# Altium project PowCarbinBoard.PrjPCB
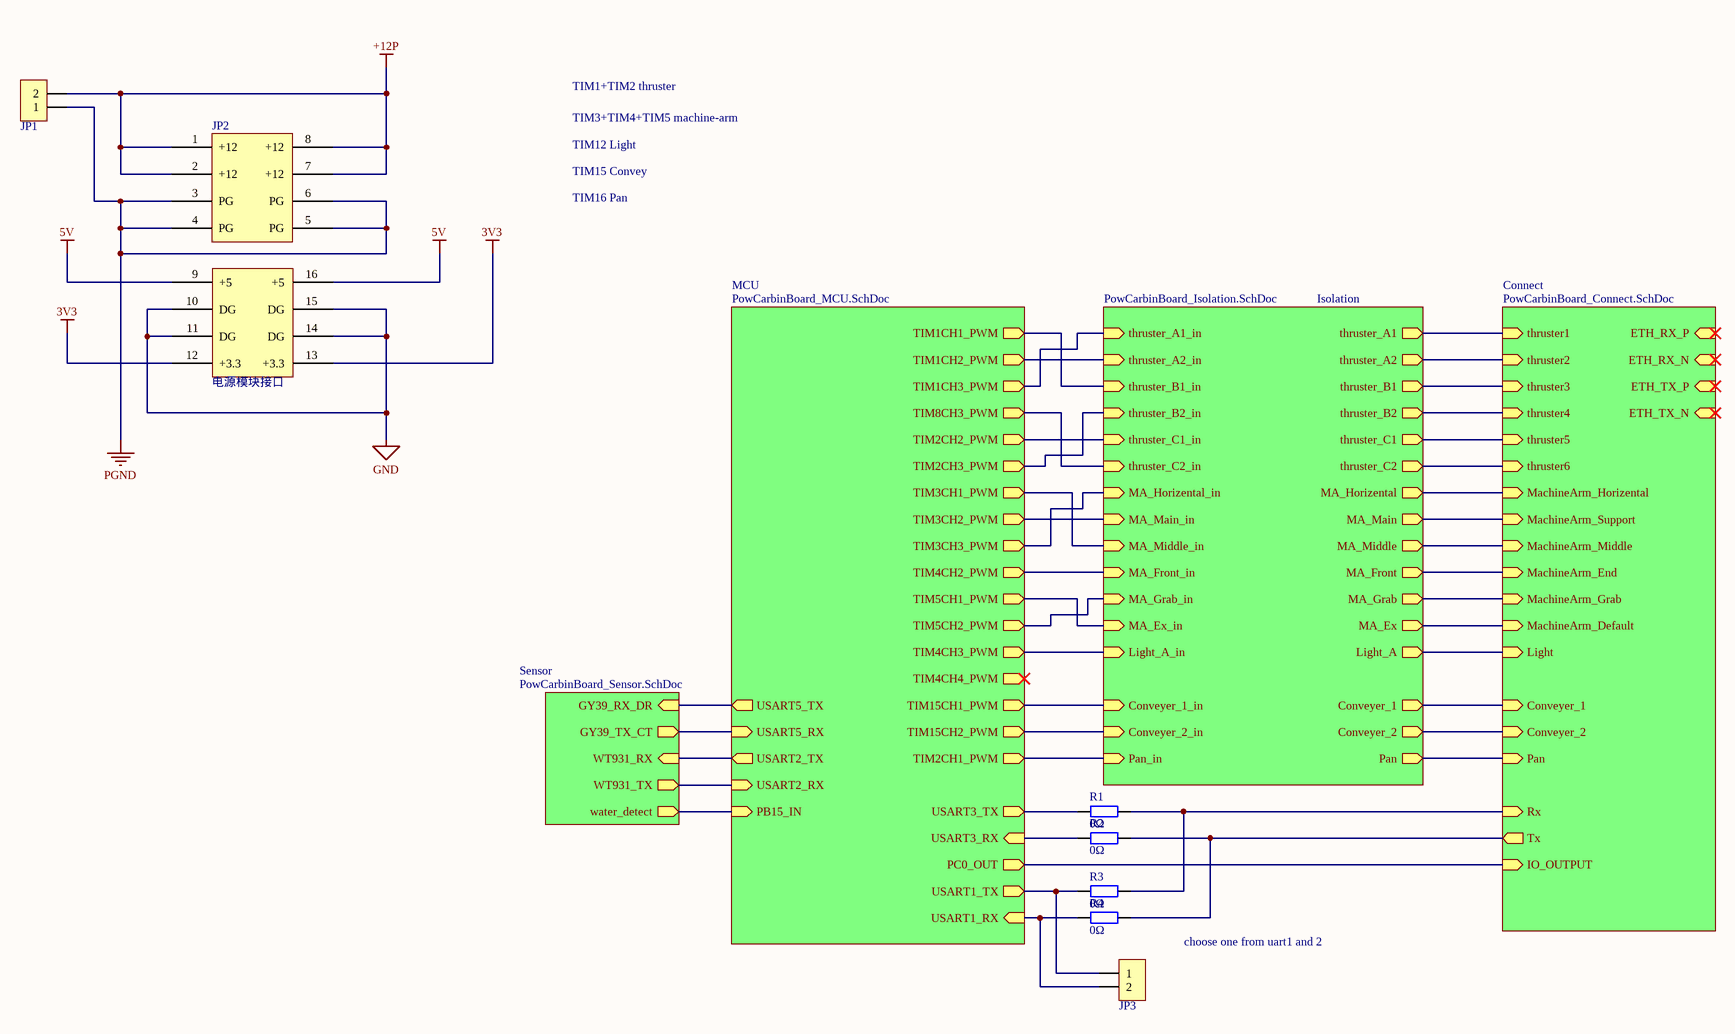
[diagram p0: PowCarbinBoard_General.SchDoc]
5 sheets, 80 parts. Net scope: hierarchical (ports join the sheet entries above them; power ports are global).
Board file: PowCarbinBoard.PcbDoc
Sheets:
  PowCarbinBoard_General.SchDoc
    MCU = PowCarbinBoard_MCU.SchDoc
    Connect = PowCarbinBoard_Connect.SchDoc
    Sensor = PowCarbinBoard_Sensor.SchDoc
    Isolation = PowCarbinBoard_Isolation.SchDoc

## Sheet PowCarbinBoard_General.SchDoc
size A3

### Parts
JP1  HDR-1X2  [KF128-5.08-2P]  (value not drawn)
JP2  电源模块接口  [排针-座 2*4]
JP3  HDR-1X2  [HDR2.54-LI-2P]  (value not drawn)
R1  0Ω  [R 0603_L]
R2  0Ω  [R 0603_L]
R3  0Ω  [R 0603_L]
R4  0Ω  [R 0603_L]

### Sub-sheets
Connect = PowCarbinBoard_Connect.SchDoc: MachineArm_End (in), MachineArm_Default (in), ETH_TX_P (in), MachineArm_Grab (in), Conveyer_2 (in), IO_OUTPUT (in), Conveyer_1 (in), ETH_RX_P (in), MachineArm_Support (in), ETH_RX_N (in), thruster6 (in), Rx (in), thruster1 (in), ETH_TX_N (in), MachineArm_Horizental (in), Light (in), thruster5 (in), MachineArm_Middle (in), Tx (out), thruster3 (in), thruster2 (in), Pan (in), thruster4 (in)
Isolation = PowCarbinBoard_Isolation.SchDoc: thruster_A2_in (in), MA_Grab (out), Conveyer_1 (out), MA_Ex_in (in), MA_Middle_in (in), thruster_B2 (out), thruster_C2_in (in), MA_Ex (out), thruster_A1 (out), thruster_B2_in (in), MA_Front_in (in), thruster_A1_in (in), Pan (out), Light_A_in (in), MA_Main (out), MA_Middle (out), thruster_C1_in (in), thruster_B1_in (in), MA_Front (out), Light_A (out), thruster_B1 (out), thruster_C1 (out), thruster_C2 (out), Pan_in (in), Conveyer_2_in (in), MA_Grab_in (in), MA_Main_in (in), thruster_A2 (out), Conveyer_2 (out), MA_Horizental (out), MA_Horizental_in (in), Conveyer_1_in (in)
MCU = PowCarbinBoard_MCU.SchDoc: TIM3CH2_PWM (out), USART2_RX (in), TIM3CH1_PWM (out), TIM2CH3_PWM (out), TIM2CH2_PWM (out), TIM2CH1_PWM (out), TIM1CH2_PWM (out), TIM1CH3_PWM (out), USART2_TX (out), TIM1CH1_PWM (out), USART1_RX (in), USART1_TX (out), USART3_RX (in), USART5_RX (in), USART3_TX (out), TIM5CH2_PWM (out), USART5_TX (out), TIM15CH2_PWM (out), TIM5CH1_PWM (out), TIM4CH2_PWM (out), TIM15CH1_PWM (out), PB15_IN (in), PC0_OUT (out), TIM3CH3_PWM (out), TIM4CH4_PWM (out), TIM4CH3_PWM (out), TIM8CH3_PWM (out)
Sensor = PowCarbinBoard_Sensor.SchDoc: water_detect (out), GY39_TX_CT (out), WT931_RX (in), GY39_RX_DR (in), WT931_TX (out)

### Nets
3V3: JP2.12(+3.3) JP2.13(+3.3)
5V: JP2.9(+5) JP2.16(+5)
+12P: JP1.2 JP2.1(+12) JP2.2(+12) JP2.7(+12) JP2.8(+12)
GND: JP2.10(DG) JP2.11(DG) JP2.14(DG) JP2.15(DG)
PGND: JP1.1 JP2.3(PG) JP2.4(PG) JP2.5(PG) JP2.6(PG)
NetJ1_1: sheet Connect/MachineArm_Horizental, sheet Isolation/MA_Horizental
NetJ1_2: sheet Connect/MachineArm_Support, sheet Isolation/MA_Main
NetJ1_3: sheet Connect/MachineArm_Middle, sheet Isolation/MA_Middle
NetJ2_1: sheet Connect/MachineArm_End, sheet Isolation/MA_Front
NetJ2_2: sheet Connect/MachineArm_Grab, sheet Isolation/MA_Grab
NetJ2_3: sheet Connect/MachineArm_Default, sheet Isolation/MA_Ex
NetJ3_1: sheet Connect/Conveyer_1, sheet Isolation/Conveyer_1
NetJ3_2: sheet Connect/Conveyer_2, sheet Isolation/Conveyer_2
NetJ4_1: sheet Connect/Light, sheet Isolation/Light_A
NetJ5_1: sheet Connect/Pan, sheet Isolation/Pan
NetJ6_1: R1.2 R3.2 ; sheet Connect/Rx
NetJ6_2: R2.2 R4.2 ; sheet Connect/Tx
NetJ9_2: sheet MCU/USART5_TX, sheet Sensor/GY39_RX_DR
NetJ9_3: sheet MCU/USART5_RX, sheet Sensor/GY39_TX_CT
NetJ13_6: sheet MCU/USART2_TX, sheet Sensor/WT931_RX
NetJ13_7: sheet MCU/USART2_RX, sheet Sensor/WT931_TX
NetJP3_1: JP3.1 R3.1 ; sheet MCU/USART1_TX
NetJP3_2: JP3.2 R4.1 ; sheet MCU/USART1_RX
NetJP4_1: sheet Connect/thruster1, sheet Isolation/thruster_A1
NetJP5_1: sheet Connect/thruster2, sheet Isolation/thruster_A2
NetJP6_1: sheet Connect/thruster3, sheet Isolation/thruster_B1
NetJP7_1: sheet Connect/thruster4, sheet Isolation/thruster_B2
NetJP8_1: sheet Connect/thruster5, sheet Isolation/thruster_C1
NetJP9_1: sheet Connect/thruster6, sheet Isolation/thruster_C2
NetM1_6: R2.1 ; sheet MCU/USART3_RX
NetM1_9: R1.1 ; sheet MCU/USART3_TX
NetM1_12: sheet MCU/TIM2CH3_PWM, sheet Isolation/thruster_B2_in
NetM1_14: sheet MCU/PB15_IN, sheet Sensor/water_detect
NetM1_15: sheet MCU/TIM1CH3_PWM, sheet Isolation/thruster_A1_in
NetM1_17: sheet MCU/TIM1CH2_PWM, sheet Isolation/thruster_A2_in
NetM1_19: sheet MCU/TIM1CH1_PWM, sheet Isolation/thruster_B1_in
NetM1_26: sheet MCU/TIM3CH3_PWM, sheet Isolation/MA_Horizental_in
NetM1_27: sheet MCU/TIM3CH2_PWM, sheet Isolation/MA_Main_in
NetM1_29: sheet MCU/TIM2CH1_PWM, sheet Isolation/Pan_in
NetM1_30: sheet MCU/TIM3CH1_PWM, sheet Isolation/MA_Middle_in
NetM1_33: sheet MCU/TIM5CH2_PWM, sheet Isolation/MA_Grab_in
NetM1_36: sheet MCU/TIM5CH1_PWM, sheet Isolation/MA_Ex_in
NetM1_40: sheet MCU/PC0_OUT, sheet Connect/IO_OUTPUT
NetM1_49: sheet MCU/TIM4CH3_PWM, sheet Isolation/Light_A_in
NetM1_52: sheet MCU/TIM4CH2_PWM, sheet Isolation/MA_Front_in
NetM1_60: sheet MCU/TIM2CH2_PWM, sheet Isolation/thruster_C1_in
NetM1_72: sheet MCU/TIM15CH1_PWM, sheet Isolation/Conveyer_1_in
NetM1_74: sheet MCU/TIM15CH2_PWM, sheet Isolation/Conveyer_2_in
NetM1_76: sheet MCU/TIM8CH3_PWM, sheet Isolation/thruster_C2_in

### Notes on the sheet
- TIM1+TIM2 thruster
- TIM3+TIM4+TIM5 machine-arm
- TIM12 Light
- TIM15 Convey
- TIM16 Pan
- choose one from uart1 and 2

### Library data of the parts
JP1 JP3 = Header 2: 2P接插件; 版权归属: 源创客; BOM名称: 2P接插件; 学习资源: www.ooocke.com
R1-R4 = R: 贴片电阻; 版权归属: 源创客; BOM名称: 贴片电阻; 学习资源: www.ooocke.com

## Sheet PowCarbinBoard_MCU.SchDoc
size A3
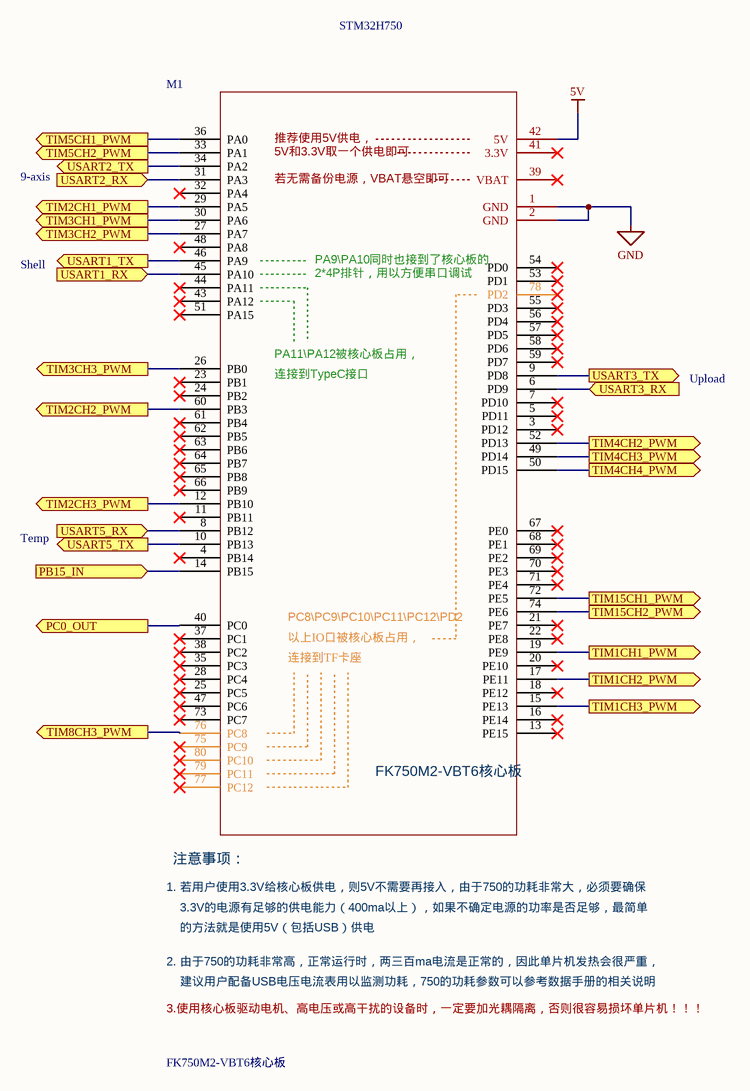
[diagram p1: PowCarbinBoard_MCU.SchDoc]

### Parts
M1  FK750M2-VBT6核心板  [FK750M2-VBT6(精简版)]

### Ports
PB15_IN (in), PC0_OUT (out), TIM1CH1_PWM (out), TIM1CH2_PWM (out), TIM1CH3_PWM (out), TIM2CH1_PWM (out), TIM2CH2_PWM (out), TIM2CH3_PWM (out), TIM3CH1_PWM (out), TIM3CH2_PWM (out), TIM3CH3_PWM (out), TIM4CH2_PWM (out), TIM4CH3_PWM (out), TIM4CH4_PWM (out), TIM5CH1_PWM (out), TIM5CH2_PWM (out), TIM8CH3_PWM (out), TIM15CH1_PWM (out), TIM15CH2_PWM (out), USART1_RX (in), USART1_TX (out), USART2_RX (in), USART2_TX (out), USART3_RX (in), USART3_TX (out), USART5_RX (in), USART5_TX (out)

### Nets
5V: M1.42(5V)
GND: M1.1(GND) M1.2(GND)
NetJ9_2: M1.10(PB13) ; port USART5_TX
NetJ9_3: M1.8(PB12) ; port USART5_RX
NetJ13_6: M1.34(PA2) ; port USART2_TX
NetJ13_7: M1.31(PA3) ; port USART2_RX
NetJP3_1: M1.46(PA9) ; port USART1_TX
NetJP3_2: M1.45(PA10) ; port USART1_RX
NetM1_6: M1.6(PD9) ; port USART3_RX
NetM1_9: M1.9(PD8) ; port USART3_TX
NetM1_12: M1.12(PB10) ; port TIM2CH3_PWM
NetM1_14: M1.14(PB15) ; port PB15_IN
NetM1_15: M1.15(PE13) ; port TIM1CH3_PWM
NetM1_17: M1.17(PE11) ; port TIM1CH2_PWM
NetM1_19: M1.19(PE9) ; port TIM1CH1_PWM
NetM1_26: M1.26(PB0) ; port TIM3CH3_PWM
NetM1_27: M1.27(PA7) ; port TIM3CH2_PWM
NetM1_29: M1.29(PA5) ; port TIM2CH1_PWM
NetM1_30: M1.30(PA6) ; port TIM3CH1_PWM
NetM1_33: M1.33(PA1) ; port TIM5CH2_PWM
NetM1_36: M1.36(PA0) ; port TIM5CH1_PWM
NetM1_40: M1.40(PC0) ; port PC0_OUT
NetM1_49: M1.49(PD14) ; port TIM4CH3_PWM
NetM1_50: M1.50(PD15) ; port TIM4CH4_PWM
NetM1_52: M1.52(PD13) ; port TIM4CH2_PWM
NetM1_60: M1.60(PB3) ; port TIM2CH2_PWM
NetM1_72: M1.72(PE5) ; port TIM15CH1_PWM
NetM1_74: M1.74(PE6) ; port TIM15CH2_PWM
NetM1_76: M1.76(PC8) ; port TIM8CH3_PWM

Not connected (* = marked no-connect by the designer): M1 3(PD12)* 4(PB14)* 5(PD11)* 7(PD10)* 11(PB11)* 13(PE15)* 16(PE14)* 18(PE12)* 20(PE10)* 21(PE7)* 22(PE8)* 23(PB1)* 24(PB2)* 25(PC5)* 28(PC4)* 32(PA4)* 35(PC3)* 37(PC1)* 38(PC2)* 39(VBAT)* 41(3.3V)* 43(PA12)* 44(PA11)* 47(PC6)* 48(PA8)* 51(PA15)* 53(PD1)* 54(PD0)* 55(PD3)* 56(PD4)* 57(PD5)* 58(PD6)* 59(PD7)* 61(PB4)* 62(PB5)* 63(PB6)* 64(PB7)* 65(PB8)* 66(PB9)* 67(PE0)* 68(PE1)* 69(PE2)* 70(PE3)* 71(PE4)* 73(PC7)* 75(PC9)* 77(PC12)* 78(PD2)* 79(PC11)* 80(PC10)*

### Notes on the sheet
- STM32H750
- 9-axis
- Shell
- Upload
- Temp
- (in symbol FK750M2-VBT6) 推荐使用5V供电，; 5V和3.3V取一个供电即可; 若无需备份电源，VBAT悬空即可; PA9\PA10同时也接到了核心板的; 2*4P排针，用以方便串口调试; PA11\PA12被核心板占用，; 连接到TypeC接口; PC8\PC9\PC10\PC11\PC12\PD2; 以上IO口被核心板占用，; 连接到TF卡座; 注意事项：; 1. 若用户使用3.3V给核心板供电，则5V不需要再接入，由于750的功耗非常大，必须要确保; 3.3V的电源有足够的供电能力（400ma以上），如果不确定电源的功率是否足够，最简单; 的方法就是使用5V（包括USB）供电; 2. 由于750的功耗非常高，正常运行时，两三百ma电流是正常的，因此单片机发热会很严重，; 建议用户配备USB电压电流表用以监测功耗，750的功耗参数可以参考数据手册的相关说明; 3.使用核心板驱动电机、高电压或高干扰的设备时，一定要加光耦隔离，否则很容易损坏单片机！！！

### Library data of the parts
M1 = FK750M2-VBT6

## Sheet PowCarbinBoard_Connect.SchDoc
size A3
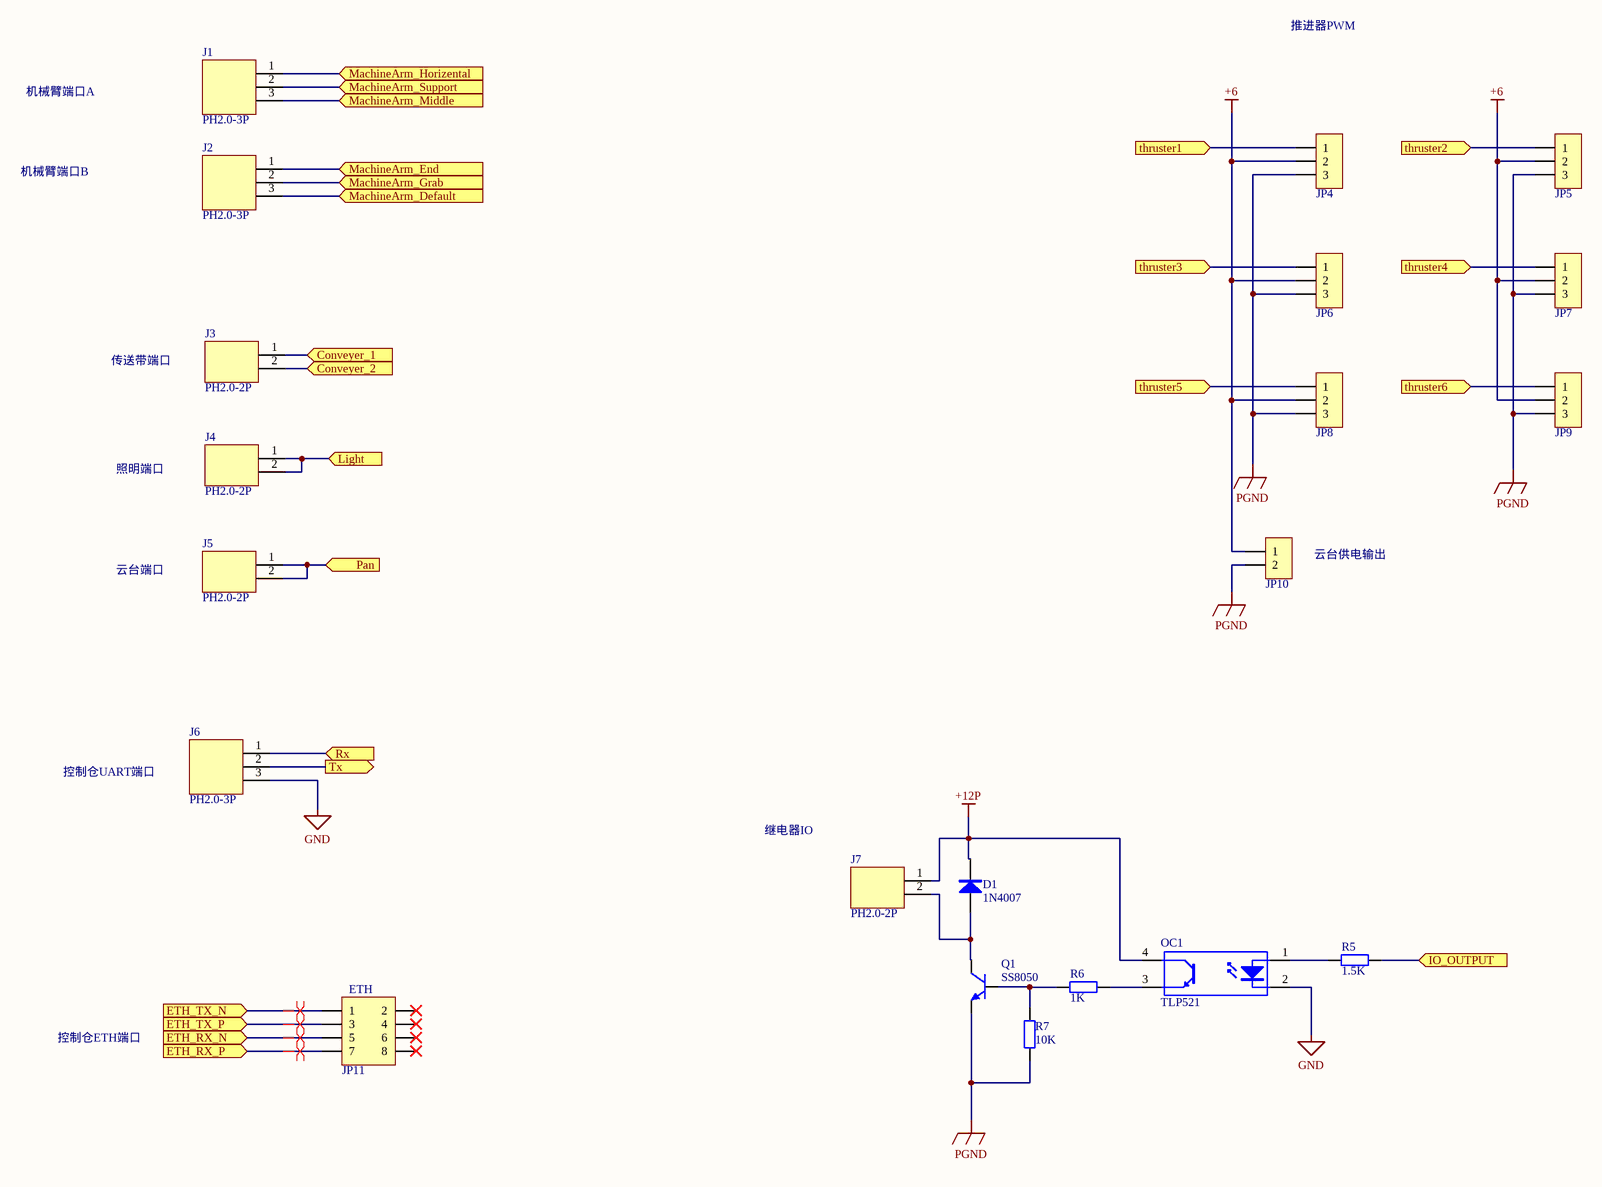
[diagram p2: PowCarbinBoard_Connect.SchDoc]

### Parts
D1  1N4007  [SOD-123]
J1  PH2.0-3P  [PH2.0-3P]
J2  PH2.0-3P  [PH2.0-3P]
J3  PH2.0-2P  [PH2.0-2P]
J4  PH2.0-2P  [PH2.0-2P]
J5  PH2.0-2P  [PH2.0-2P]
J6  PH2.0-3P  [PH2.0-3P]
J7  PH2.0-2P  [PH2.0-2P]
JP4  HDR-1X3  [HDR2.54-LI-3P]  (value not drawn)
JP5  HDR-1X3  [HDR2.54-LI-3P]  (value not drawn)
JP6  HDR-1X3  [HDR2.54-LI-3P]  (value not drawn)
JP7  HDR-1X3  [HDR2.54-LI-3P]  (value not drawn)
JP8  HDR-1X3  [HDR2.54-LI-3P]  (value not drawn)
JP9  HDR-1X3  [HDR2.54-LI-3P]  (value not drawn)
JP10  HDR-1X2  [KF128-5.08-2P]  (value not drawn)
JP11  ETH  [PHB2.0-LI-2x4P]
OC1  TLP521  [DIP_TLP521]
Q1  SS8050  [SOT23-3N]
R5  1.5K  [0603_R]
R6  1K  [0603_R]
R7  10K  [0603_R]

### Ports
Conveyer_1 (in), Conveyer_2 (in), ETH_RX_N (in), ETH_RX_P (in), ETH_TX_N (in), ETH_TX_P (in), IO_OUTPUT (in), Light (in), MachineArm_Default (in), MachineArm_End (in), MachineArm_Grab (in), MachineArm_Horizental (in), MachineArm_Middle (in), MachineArm_Support (in), Pan (in), Rx (in), thruster1 (in), thruster2 (in), thruster3 (in), thruster4 (in), thruster5 (in), thruster6 (in), Tx (out)

### Nets
+6: JP4.2 JP5.2 JP6.2 JP7.2 JP8.2 JP9.2 JP10.1
+12P: D1.2(K) J7.1 OC1.4(C)
GND: J6.3 OC1.2(K)
PGND: JP4.3 JP5.3 JP6.3 JP7.3 JP8.3 JP9.3 JP10.2 Q1.2(E) R7.1
NetD1_1: D1.1(A) J7.2 Q1.3(C)
NetJ1_1: J1.1 ; port MachineArm_Horizental
NetJ1_2: J1.2 ; port MachineArm_Support
NetJ1_3: J1.3 ; port MachineArm_Middle
NetJ2_1: J2.1 ; port MachineArm_End
NetJ2_2: J2.2 ; port MachineArm_Grab
NetJ2_3: J2.3 ; port MachineArm_Default
NetJ3_1: J3.1 ; port Conveyer_1
NetJ3_2: J3.2 ; port Conveyer_2
NetJ4_1: J4.1 J4.2 ; port Light
NetJ5_1: J5.1 J5.2 ; port Pan
NetJ6_1: J6.1 ; port Rx
NetJ6_2: J6.2 ; port Tx
NetJP4_1: JP4.1 ; port thruster1
NetJP5_1: JP5.1 ; port thruster2
NetJP6_1: JP6.1 ; port thruster3
NetJP7_1: JP7.1 ; port thruster4
NetJP8_1: JP8.1 ; port thruster5
NetJP9_1: JP9.1 ; port thruster6
NetJP11_1: JP11.1 ; port ETH_TX_N
NetJP11_3: JP11.3 ; port ETH_TX_P
NetJP11_5: JP11.5 ; port ETH_RX_N
NetJP11_7: JP11.7 ; port ETH_RX_P
NetM1_40: R5.2 ; port IO_OUTPUT
NetOC1_1: OC1.1(A) R5.1
NetOC1_3: OC1.3(E) R6.1
NetQ1_1: Q1.1(B) R6.2 R7.2

Not connected (* = marked no-connect by the designer): JP11 2* 4* 6* 8*

### Layout directives
differential pair: NetJP11_1, NetJP11_3, NetJP11_5, NetJP11_7

### Notes on the sheet
- 推进器PWM
- 机械臂端口A
- 机械臂端口B
- 传送带端口
- 照明端口
- 云台端口
- (near JP10) 云台供电输出
- 控制仓UART端口
- 继电器IO
- 控制仓ETH端口

### Library data of the parts
D1 = 1N4007: 整流二极管; 版权归属: 源创客; BOM名称: 整流二极管; 学习资源: www.ooocke.com
JP4-JP9 = Header 3: 3P接插件; 版权归属: 源创客; BOM名称: 3P接插件; 学习资源: www.ooocke.com
JP10 = Header 2: 2P接插件; 版权归属: 源创客; BOM名称: 2P接插件; 学习资源: www.ooocke.com
JP11 = Header 4X2: 4*2P接插件; 版权归属: 源创客; BOM名称: 4*2P接插件; 学习资源: www.ooocke.com
OC1 = TLP521: 开关光耦
Q1 = 8050-SMD: 高频放大-NPN型; 版权归属: 源创客; 属性: 40V 1.5A 1W 100MHZ; BOM名称: 高频放大-NPN型; 学习资源: www.ooocke.com
R5-R7 = 0603 10KΩ (1002) 1%: 贴片电阻; ComponentLink1Description: 供应商链接; ComponentLink1URL: http://www.szlcsc.com/product/details_26547.html; Package: 0603; Supplier: LC; SuppliersPartNumber: C25804

## Sheet PowCarbinBoard_Sensor.SchDoc
size A3
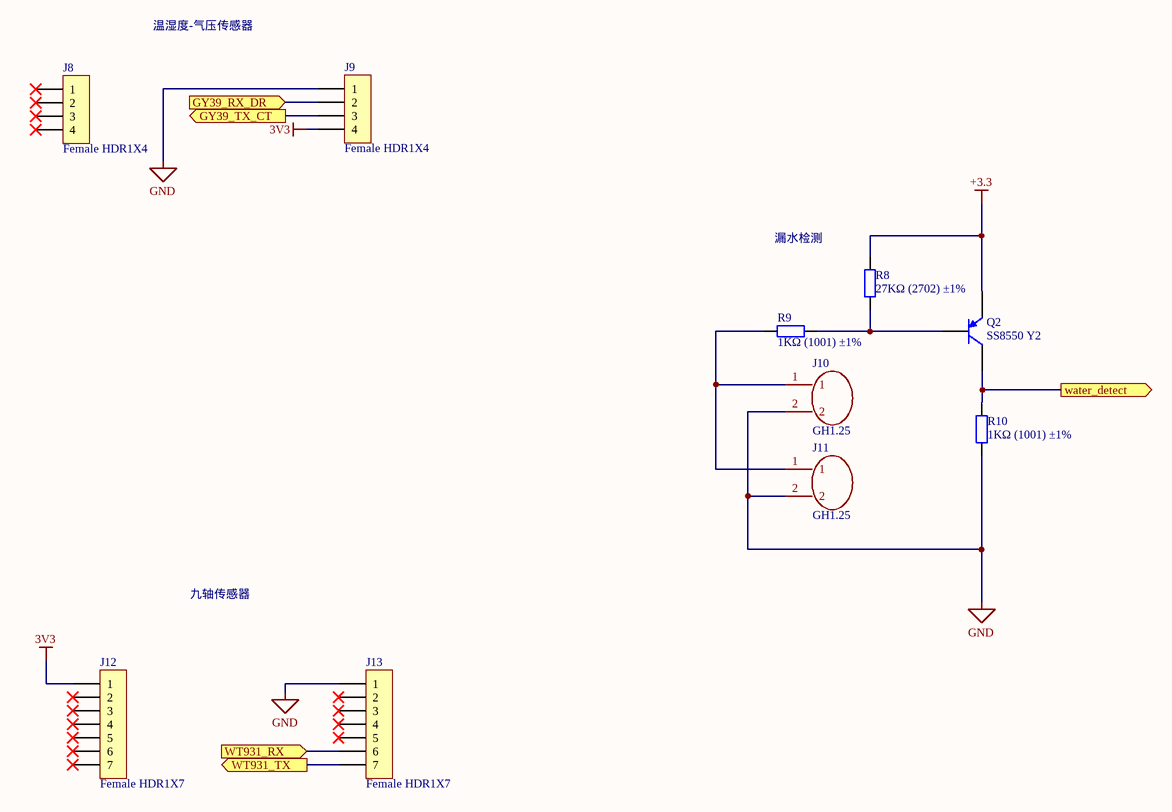
[diagram p3: PowCarbinBoard_Sensor.SchDoc]

### Parts
J8  Female HDR1X4  [Fe-HDR1X4/2.54-S]
J9  Female HDR1X4  [Fe-HDR1X4/2.54-S]
J10  GH1.25  [GH1.25 2pin]
J11  GH1.25  [GH1.25 2pin]
J12  Female HDR1X7  [Fe-HDR1X7/2.54-S]
J13  Female HDR1X7  [Fe-HDR1X7/2.54-S]
Q2  SS8550 Y2  [SOT-23(SOT-23-3)]
R8  27KΩ (2702) ±1%  [0603_R]
R9  1KΩ (1001) ±1%  [0603_R]
R10  1KΩ (1001) ±1%  [0603_R]

### Ports
GY39_RX_DR (in), GY39_TX_CT (out), water_detect (out), WT931_RX (in), WT931_TX (out)

### Nets
3V3: J9.4 J12.1
+3.3: Q2.2(E) R8.2
GND: J9.1 J10.2 J11.2 J13.1 R10.1
NetJ9_2: J9.2 ; port GY39_RX_DR
NetJ9_3: J9.3 ; port GY39_TX_CT
NetJ10_1: J10.1 J11.1 R9.1
NetJ13_6: J13.6 ; port WT931_RX
NetJ13_7: J13.7 ; port WT931_TX
NetM1_14: Q2.3(C) R10.2 ; port water_detect
NetQ2_1: Q2.1(B) R8.1 R9.2

Not connected (* = marked no-connect by the designer): J8 1* 2* 3* 4*; J12 2* 3* 4* 5* 6* 7*; J13 2* 3* 4* 5*

### Notes on the sheet
- 温湿度-气压传感器
- 漏水检测
- 九轴传感器

### Library data of the parts
J10 J11 = GH1.25 2pin
Q2 = SOT-23 SS8550 Y2: 三极管; ComponentLink1Description: 供应商链接; ComponentLink1URL: http://www.szlcsc.com/product/details_9037.html; Package: SOT-23; Supplier: LC; SuppliersPartNumber: C8542
R8 = 0603 27KΩ (2702) 1%: 贴片电阻; ComponentLink1Description: 供应商链接; ComponentLink1URL: http://www.szlcsc.com/product/details_23694.html; Package: 0603; Supplier: LC; SuppliersPartNumber: C22967
R9 R10 = 0603 1KΩ (1001) 1%: 贴片电阻; ComponentLink1Description: 供应商链接; ComponentLink1URL: http://www.szlcsc.com/product/details_21904.html; Package: 0603; Supplier: LC; SuppliersPartNumber: C21190

## Sheet PowCarbinBoard_Isolation.SchDoc
size A3
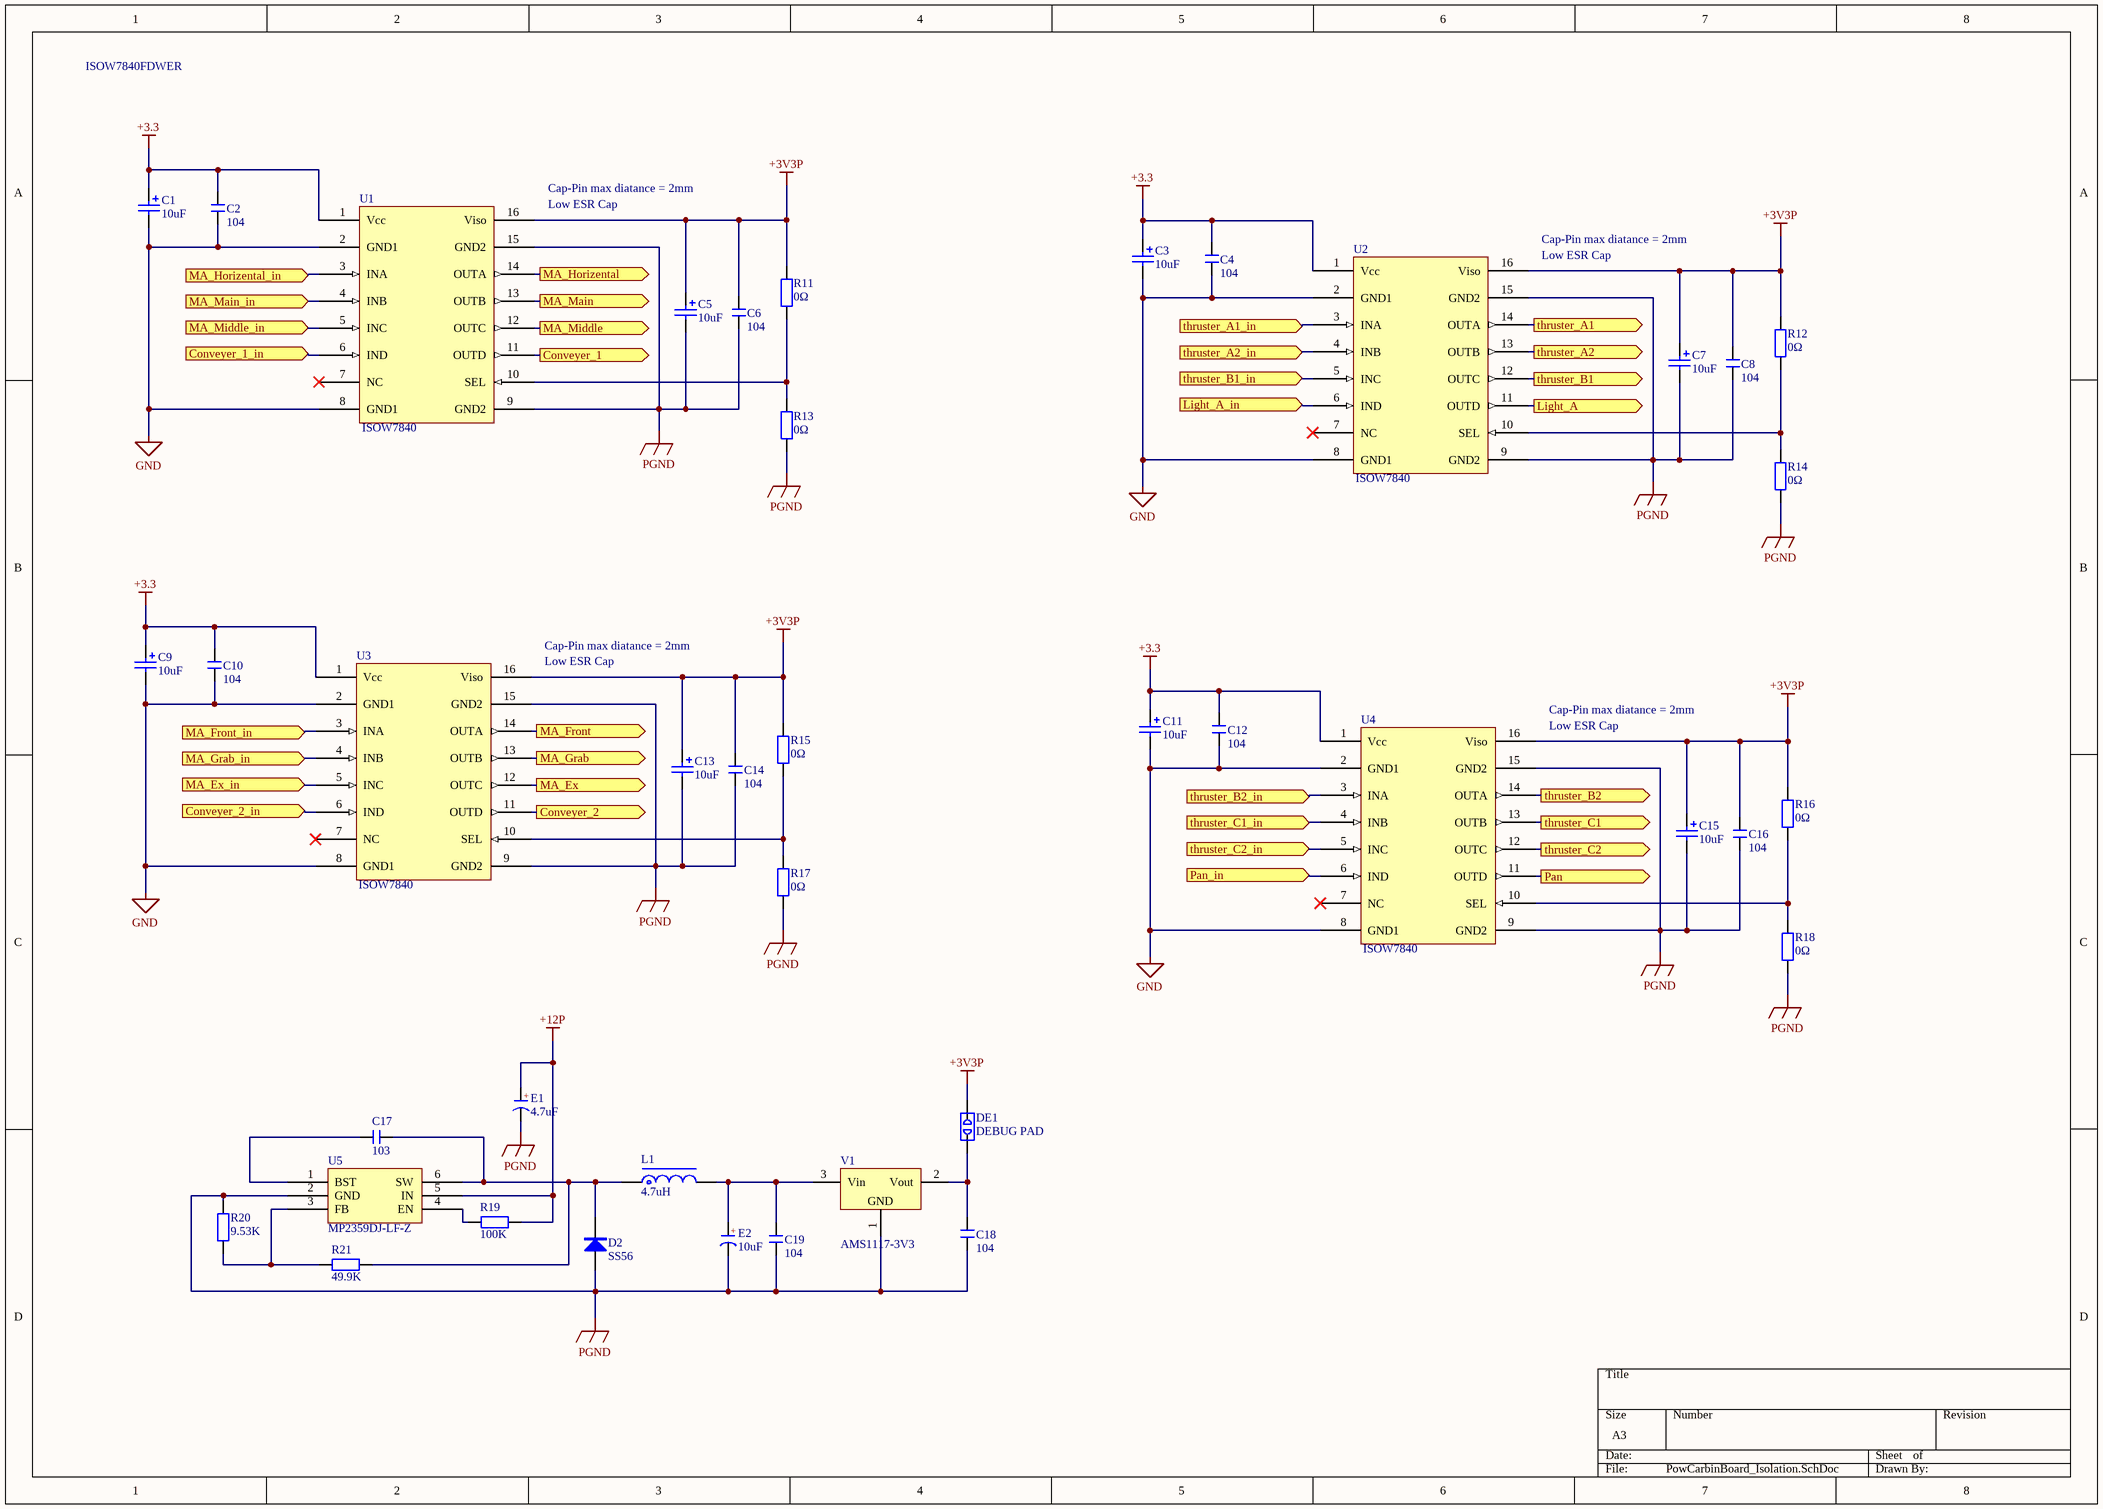
[diagram p4: PowCarbinBoard_Isolation.SchDoc]

### Parts
C1  10uF  [CASE-B_3528]
C2  104  [C 0603_L]
C3  10uF  [CASE-B_3528]
C4  104  [C 0603_L]
C5  10uF  [CASE-B_3528]
C6  104  [C 0603_L]
C7  10uF  [CASE-B_3528]
C8  104  [C 0603_L]
C9  10uF  [CASE-B_3528]
C10  104  [C 0603_L]
C11  10uF  [CASE-B_3528]
C12  104  [C 0603_L]
C13  10uF  [CASE-B_3528]
C14  104  [C 0603_L]
C15  10uF  [CASE-B_3528]
C16  104  [C 0603_L]
C17  103  [C 0603_L]
C18  104  [C 0603_L]
C19  104  [C 0603_L]
D2  SS56  [SMA]
DE1  DEBUG PAD  [DEBUG_A]
E1  4.7uF  [CM B(4*5.4)]
E2  10uF  [CM B(4*5.4)]
L1  4.7uH  [CDRH74]
R11  0Ω  [R 0603_L]
R12  0Ω  [R 0603_L]
R13  0Ω  [R 0603_L]
R14  0Ω  [R 0603_L]
R15  0Ω  [R 0603_L]
R16  0Ω  [R 0603_L]
R17  0Ω  [R 0603_L]
R18  0Ω  [R 0603_L]
R19  100K  [R 0603_L]
R20  9.53K  [R 0603_L]
R21  49.9K  [R 0603_L]
U1  ISOW7840  [ISOW7840]
U2  ISOW7840  [ISOW7840]
U3  ISOW7840  [ISOW7840]
U4  ISOW7840  [ISOW7840]
U5  MP2359DJ-LF-Z  [SOT-23-6]
V1  AMS1117-3V3  [SOT89_N]

### Ports
Conveyer_1 (out), Conveyer_1_in (in), Conveyer_2 (out), Conveyer_2_in (in), Light_A (out), Light_A_in (in), MA_Ex (out), MA_Ex_in (in), MA_Front (out), MA_Front_in (in), MA_Grab (out), MA_Grab_in (in), MA_Horizental (out), MA_Horizental_in (in), MA_Main (out), MA_Main_in (in), MA_Middle (out), MA_Middle_in (in), Pan (out), Pan_in (in), thruster_A1 (out), thruster_A1_in (in), thruster_A2 (out), thruster_A2_in (in), thruster_B1 (out), thruster_B1_in (in), thruster_B2 (out), thruster_B2_in (in), thruster_C1 (out), thruster_C1_in (in), thruster_C2 (out), thruster_C2_in (in)

### Nets
+3.3: C1.1 C2.2 C3.1 C4.2 C9.1 C10.2 C11.1 C12.2 U1.1(Vcc) U2.1(Vcc) U3.1(Vcc) U4.1(Vcc)
+3V3P: C5.1 C6.2 C7.1 C8.2 C13.1 C14.2 C15.1 C16.2 DE1.2 R11.2 R12.2 R15.2 R16.2 U1.16(Viso) U2.16(Viso) U3.16(Viso) U4.16(Viso)
+12P: E1.1(A) R19.1 U5.5(IN)
GND: C1.2 C2.1 C3.2 C4.1 C9.2 C10.1 C11.2 C12.1 U1.2(GND1) U1.8(GND1) U2.2(GND1) U2.8(GND1) U3.2(GND1) U3.8(GND1) U4.2(GND1) U4.8(GND1)
PGND: C5.2 C6.1 C7.2 C8.1 C13.2 C14.1 C15.2 C16.1 C18.1 C19.1 D2.1(A) E1.2(K) E2.2(K) R13.1 R14.1 R17.1 R18.1 R20.2 U1.9(GND2) U1.15(GND2) U2.9(GND2) U2.15(GND2) U3.9(GND2) U3.15(GND2) U4.9(GND2) U4.15(GND2) U5.2(GND) V1.1(GND)
NetC17_1: C17.1 D2.2(K) L1.1 R21.2 U5.6(SW)
NetC17_2: C17.2 U5.1(BST)
NetC18_2: C18.2 DE1.1 V1.2(Vout)
NetC19_2: C19.2 E2.1(A) L1.2 V1.3(Vin)
NetJ1_1: U1.14(OUTA) ; port MA_Horizental
NetJ1_2: U1.13(OUTB) ; port MA_Main
NetJ1_3: U1.12(OUTC) ; port MA_Middle
NetJ2_1: U3.14(OUTA) ; port MA_Front
NetJ2_2: U3.13(OUTB) ; port MA_Grab
NetJ2_3: U3.12(OUTC) ; port MA_Ex
NetJ3_1: U1.11(OUTD) ; port Conveyer_1
NetJ3_2: U3.11(OUTD) ; port Conveyer_2
NetJ4_1: U2.11(OUTD) ; port Light_A
NetJ5_1: U4.11(OUTD) ; port Pan
NetJP4_1: U2.14(OUTA) ; port thruster_A1
NetJP5_1: U2.13(OUTB) ; port thruster_A2
NetJP6_1: U2.12(OUTC) ; port thruster_B1
NetJP7_1: U4.14(OUTA) ; port thruster_B2
NetJP8_1: U4.13(OUTB) ; port thruster_C1
NetJP9_1: U4.12(OUTC) ; port thruster_C2
NetM1_12: U4.3(INA) ; port thruster_B2_in
NetM1_15: U2.3(INA) ; port thruster_A1_in
NetM1_17: U2.4(INB) ; port thruster_A2_in
NetM1_19: U2.5(INC) ; port thruster_B1_in
NetM1_26: U1.3(INA) ; port MA_Horizental_in
NetM1_27: U1.4(INB) ; port MA_Main_in
NetM1_29: U4.6(IND) ; port Pan_in
NetM1_30: U1.5(INC) ; port MA_Middle_in
NetM1_33: U3.4(INB) ; port MA_Grab_in
NetM1_36: U3.5(INC) ; port MA_Ex_in
NetM1_49: U2.6(IND) ; port Light_A_in
NetM1_52: U3.3(INA) ; port MA_Front_in
NetM1_60: U4.4(INB) ; port thruster_C1_in
NetM1_72: U1.6(IND) ; port Conveyer_1_in
NetM1_74: U3.6(IND) ; port Conveyer_2_in
NetM1_76: U4.5(INC) ; port thruster_C2_in
NetR11_1: R11.1 R13.2 U1.10(SEL)
NetR12_1: R12.1 R14.2 U2.10(SEL)
NetR15_1: R15.1 R17.2 U3.10(SEL)
NetR16_1: R16.1 R18.2 U4.10(SEL)
NetR19_2: R19.2 U5.4(EN)
NetR20_1: R20.1 R21.1 U5.3(FB)

Not connected (* = marked no-connect by the designer): U1 7(NC)*; U2 7(NC)*; U3 7(NC)*; U4 7(NC)*

### Notes on the sheet
- ISOW7840FDWER
- Cap-Pin max diatance = 2mm
- (near U1) Low ESR Cap
- (near U2) Low ESR Cap
- (near U3) Low ESR Cap
- (near U4) Low ESR Cap
- (in symbol C-CM) +

### Library data of the parts
C1 C3 C5 C7 C9 C11 C13 C15 = 3528 100uF (107) 10% 6.3V: 钽电容; ComponentLink1Description: 供应商链接; ComponentLink1URL: http://www.szlcsc.com/product/details_16815.html; Package: 3528; Supplier: LC; SuppliersPartNumber: C16133
C2 C4 C6 C8 C10 C12 C14 C16-C19 = C: 无极性贴片电容; 版权归属: 源创客; BOM名称: 无极性贴片电容; 学习资源: www.ooocke.com
D2 = SS14: 肖特基二极管; 版权归属: 源创客; 属性: 40V/1A; BOM名称: 肖特基二极管; 学习资源: www.ooocke.com
DE1 = DEBUG: 调试断点焊盘; 版权归属: 源创客; BOM名称: 调试断点焊盘; 学习资源: www.ooocke.com
E1 E2 = C-CM: 贴片电解电容; 版权归属: 源创客; BOM名称: 贴片电解电容; 学习资源: www.ooocke.com
L1 = L-CDRH: 功率屏蔽电感; 版权归属: 源创客; BOM名称: 功率屏蔽电感; 学习资源: www.ooocke.com
R11-R21 = R: 贴片电阻; 版权归属: 源创客; BOM名称: 贴片电阻; 学习资源: www.ooocke.com
U5 = MP2359DJ-LF-Z_[C14259]: DC-DC芯片; ComponentLink1Description: 供应商链接; ComponentLink1URL: http://www.szlcsc.com/product/details_14917.html; Package: SOT-23-6; Supplier: LC; SuppliersPartNumber: C14259
V1 = AMS1117: 三端稳压芯片; BOM名称: 稳压芯片; 版权归属: 源创客; 学习资源: www.ooocke.com

## Nets that join several sheets
3V3: PowCarbinBoard_General (JP2.12 JP2.13), PowCarbinBoard_Sensor (J9.4 J12.1)
5V: PowCarbinBoard_General (JP2.9 JP2.16), PowCarbinBoard_MCU (M1.42)
+3.3: PowCarbinBoard_Sensor (Q2.2 R8.2), PowCarbinBoard_Isolation (12 pins)
+12P: PowCarbinBoard_General (5 pins), PowCarbinBoard_Connect (D1.2 J7.1 OC1.4), PowCarbinBoard_Isolation (E1.1 R19.1 U5.5)
GND: PowCarbinBoard_General (JP2.10 JP2.11 JP2.14 JP2.15), PowCarbinBoard_MCU (M1.1 M1.2), PowCarbinBoard_Connect (J6.3 OC1.2), PowCarbinBoard_Sensor (5 pins), PowCarbinBoard_Isolation (16 pins)
PGND: PowCarbinBoard_General (5 pins), PowCarbinBoard_Connect (9 pins), PowCarbinBoard_Isolation (28 pins)
NetJ1_1: PowCarbinBoard_Connect (J1.1), PowCarbinBoard_Isolation (U1.14)
NetJ1_2: PowCarbinBoard_Connect (J1.2), PowCarbinBoard_Isolation (U1.13)
NetJ1_3: PowCarbinBoard_Connect (J1.3), PowCarbinBoard_Isolation (U1.12)
NetJ2_1: PowCarbinBoard_Connect (J2.1), PowCarbinBoard_Isolation (U3.14)
NetJ2_2: PowCarbinBoard_Connect (J2.2), PowCarbinBoard_Isolation (U3.13)
NetJ2_3: PowCarbinBoard_Connect (J2.3), PowCarbinBoard_Isolation (U3.12)
NetJ3_1: PowCarbinBoard_Connect (J3.1), PowCarbinBoard_Isolation (U1.11)
NetJ3_2: PowCarbinBoard_Connect (J3.2), PowCarbinBoard_Isolation (U3.11)
NetJ4_1: PowCarbinBoard_Connect (J4.1 J4.2), PowCarbinBoard_Isolation (U2.11)
NetJ5_1: PowCarbinBoard_Connect (J5.1 J5.2), PowCarbinBoard_Isolation (U4.11)
NetJ6_1: PowCarbinBoard_General (R1.2 R3.2), PowCarbinBoard_Connect (J6.1)
NetJ6_2: PowCarbinBoard_General (R2.2 R4.2), PowCarbinBoard_Connect (J6.2)
NetJ9_2: PowCarbinBoard_MCU (M1.10), PowCarbinBoard_Sensor (J9.2)
NetJ9_3: PowCarbinBoard_MCU (M1.8), PowCarbinBoard_Sensor (J9.3)
NetJ13_6: PowCarbinBoard_MCU (M1.34), PowCarbinBoard_Sensor (J13.6)
NetJ13_7: PowCarbinBoard_MCU (M1.31), PowCarbinBoard_Sensor (J13.7)
NetJP3_1: PowCarbinBoard_General (JP3.1 R3.1), PowCarbinBoard_MCU (M1.46)
NetJP3_2: PowCarbinBoard_General (JP3.2 R4.1), PowCarbinBoard_MCU (M1.45)
NetJP4_1: PowCarbinBoard_Connect (JP4.1), PowCarbinBoard_Isolation (U2.14)
NetJP5_1: PowCarbinBoard_Connect (JP5.1), PowCarbinBoard_Isolation (U2.13)
NetJP6_1: PowCarbinBoard_Connect (JP6.1), PowCarbinBoard_Isolation (U2.12)
NetJP7_1: PowCarbinBoard_Connect (JP7.1), PowCarbinBoard_Isolation (U4.14)
NetJP8_1: PowCarbinBoard_Connect (JP8.1), PowCarbinBoard_Isolation (U4.13)
NetJP9_1: PowCarbinBoard_Connect (JP9.1), PowCarbinBoard_Isolation (U4.12)
NetM1_6: PowCarbinBoard_General (R2.1), PowCarbinBoard_MCU (M1.6)
NetM1_9: PowCarbinBoard_General (R1.1), PowCarbinBoard_MCU (M1.9)
NetM1_12: PowCarbinBoard_MCU (M1.12), PowCarbinBoard_Isolation (U4.3)
NetM1_14: PowCarbinBoard_MCU (M1.14), PowCarbinBoard_Sensor (Q2.3 R10.2)
NetM1_15: PowCarbinBoard_MCU (M1.15), PowCarbinBoard_Isolation (U2.3)
NetM1_17: PowCarbinBoard_MCU (M1.17), PowCarbinBoard_Isolation (U2.4)
NetM1_19: PowCarbinBoard_MCU (M1.19), PowCarbinBoard_Isolation (U2.5)
NetM1_26: PowCarbinBoard_MCU (M1.26), PowCarbinBoard_Isolation (U1.3)
NetM1_27: PowCarbinBoard_MCU (M1.27), PowCarbinBoard_Isolation (U1.4)
NetM1_29: PowCarbinBoard_MCU (M1.29), PowCarbinBoard_Isolation (U4.6)
NetM1_30: PowCarbinBoard_MCU (M1.30), PowCarbinBoard_Isolation (U1.5)
NetM1_33: PowCarbinBoard_MCU (M1.33), PowCarbinBoard_Isolation (U3.4)
NetM1_36: PowCarbinBoard_MCU (M1.36), PowCarbinBoard_Isolation (U3.5)
NetM1_40: PowCarbinBoard_MCU (M1.40), PowCarbinBoard_Connect (R5.2)
NetM1_49: PowCarbinBoard_MCU (M1.49), PowCarbinBoard_Isolation (U2.6)
NetM1_52: PowCarbinBoard_MCU (M1.52), PowCarbinBoard_Isolation (U3.3)
NetM1_60: PowCarbinBoard_MCU (M1.60), PowCarbinBoard_Isolation (U4.4)
NetM1_72: PowCarbinBoard_MCU (M1.72), PowCarbinBoard_Isolation (U1.6)
NetM1_74: PowCarbinBoard_MCU (M1.74), PowCarbinBoard_Isolation (U3.6)
NetM1_76: PowCarbinBoard_MCU (M1.76), PowCarbinBoard_Isolation (U4.5)